# EAGLE schematic L298N_Schematic_v1 (EAGLE 9.7.0)
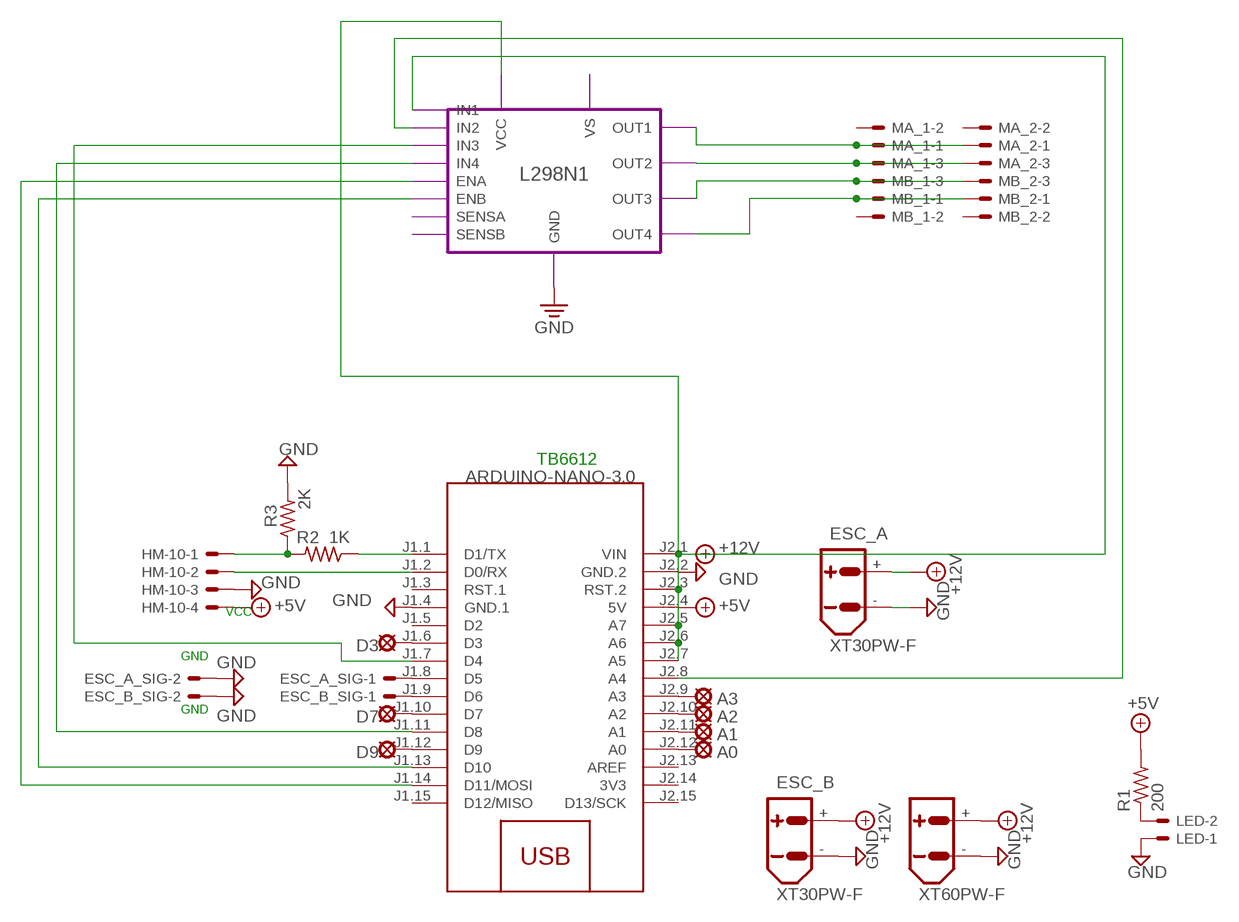
[diagram p0: schematic, sheet 1]

## Parts
A0  LSP10  [LSP10]
A1  LSP10  [LSP10]
A2  LSP10  [LSP10]
A3  LSP10  [LSP10]
BATTERY  XT60PW-F  [XT60PW-F]
D3  LSP10  [LSP10]
D7  LSP10  [LSP10]
D9  LSP10  [LSP10]
ESC_A  XT30PW-F  [XT30PW-F]
ESC_A_SIG  JST-XH-02-PIN-LONG-PAD  [JST-XH-02-PACKAGE-LONG-PAD]
ESC_B  XT30PW-F  [XT30PW-F]
ESC_B_SIG  JST-XH-02-PIN-LONG-PAD  [JST-XH-02-PACKAGE-LONG-PAD]
HM-10  JST-XH-04-PIN-LONG-PAD  [JST-XH-04-PACKAGE-LONG-PAD]
LED  JST-XH-02-PIN-LONG-PAD  [JST-XH-02-PACKAGE-LONG-PAD]
M1  ARDUINO-NANO-3.0  [ARDUINO-NANO-3.0]
MA_1  JST-XH-03-PIN-LONG-PAD  [JST-XH-03-PACKAGE-LONG-PAD]
MA_2  JST-XH-03-PIN-LONG-PAD  [JST-XH-03-PACKAGE-LONG-PAD]
MB_1  JST-XH-03-PIN-LONG-PAD  [JST-XH-03-PACKAGE-LONG-PAD]
MB_2  JST-XH-03-PIN-LONG-PAD  [JST-XH-03-PACKAGE-LONG-PAD]
R1  200  R-US_0204/5  [0204/5]
R2  1K  R-US_0204/5  [0204/5]
R3  2K  R-US_0204/5  [0204/5]

## Module instances
L298N1 = L298N

## Nets
+5V: HM-10.4 M1.J2.4(5V) R1.2
+12V: BATTERY.+ ESC_A.+ ESC_B.+ M1.J2.1(VIN)
GND: BATTERY.- ESC_A.- ESC_A_SIG.2 ESC_B.- ESC_B_SIG.2 HM-10.3 LED.1 M1.J1.4(GND.1) M1.J2.2(GND.2) R3.2 ; port L298N1.GND
N$1: D3.MP M1.J1.6(D3)
N$2: D7.MP M1.J1.10(D7)
N$3: D9.MP M1.J1.12(D9)
N$4: HM-10.1 R2.2 R3.1
N$5: ESC_A_SIG.1 M1.J1.8(D5)
N$6: ESC_B_SIG.1 M1.J1.9(D6)
N$7: M1.J1.1(D1/TX) R2.1
N$9: M1.J2.8(A4) ; port L298N1.IN2
N$10: MA_1.1 MA_2.1 ; port L298N1.OUT1
N$11: MA_1.3 MA_2.3 ; port L298N1.OUT2
N$12: MB_1.1 MB_2.1 ; port L298N1.OUT4
N$13: MB_1.3 MB_2.3 ; port L298N1.OUT3
N$14: HM-10.2 M1.J1.2(D0/RX)
N$15: M1.J2.3(RST.2) M1.J2.5(A7) M1.J2.6(A6) M1.J2.7(A5) ; port L298N1.VCC L298N1.IN1
N$16: M1.J1.7(D4) ; port L298N1.IN3
N$17: M1.J1.11(D8) ; port L298N1.IN4
N$18: LED.2 R1.1
N$20: M1.J1.13(D10) ; port L298N1.ENB
N$21: M1.J1.14(D11/MOSI) ; port L298N1.ENA
N$24: A3.MP M1.J2.9(A3)
N$25: A1.MP M1.J2.11(A1)
N$27: A0.MP M1.J2.12(A0)
N$28: A2.MP M1.J2.10(A2)
Unconnected: M1.J1.3(RST.1) M1.J1.5(D2) M1.J1.15(D12/MISO) M1.J2.13(AREF) M1.J2.15(D13/SCK) MA_1.2 MA_2.2 MB_1.2 MB_2.2

## Notes on the sheet
- TB6612
- VCC
- GND
- GND

## Power pins joined to a net without a drawn wire
3V3: M1.J2.14(3V3)

## Library data of the parts
A0 A1-A3 D3 D7 D9 = solpad:LSP10: SOLDER PAD drill 1.0 mm, distributor Buerklin, 12H555
BATTERY = xt30:XT60: AMASS XT60 connector Store in Japan AMASS XT60 connector <https://szc.jp/ams-xt60>
ESC_A ESC_B = xt30:XT30: AMASS XT30 connector Store in Japan AMASS XT30 connector <https://szc.jp/ams-xt30>
ESC_A_SIG ESC_B_SIG LED = Rembrandt Electronics - JST XH Connectors v1-0:JST-XH-02-PIN: JST XH Connector 2 Pin Wire to board connector. Pitch: 2,54 mm, (0.100") Number of pins: 2 Created by Rembrandt Electronics www.rembrandtelectronics.com
HM-10 = Rembrandt Electronics - JST XH Connectors v1-0:JST-XH-04-PIN: JST XH Connector 2 Pin Wire to board connector. Pitch: 2,54 mm, (0.100") Number of pins: 4 Created by Rembrandt Electronics www.rembrandtelectronics.com
M1 = diy-modules:ARDUINO-NANO-3.0: Arduino Nano 3.0 and compatible devices More details available here: https://www.arduino.cc/en/Main/ArduinoBoardNano Click here to find device on ebay.com <http://www.ebay.com/sch/arduino+nano>
MA_1 MA_2 MB_1 MB_2 = Rembrandt Electronics - JST XH Connectors v1-0:JST-XH-03-PIN: JST XH Connector 2 Pin Wire to board connector. Pitch: 2,54 mm, (0.100") Number of pins: 3 Created by Rembrandt Electronics www.rembrandtelectronics.com
R1-R3 = BeagleBone_Black_Wireless:R-US_: RESISTOR, American symbol

## Module L298
Ports: IN1(in) IN2(in) IN3(in) IN4(in)

### Library data of the parts

## Module L298N
Ports: IN1(oc) IN2(oc) IN3(oc) IN4(oc) ENA(oc) ENB(oc) SENSA(oc) SENSB(oc) GND(oc) VCC(oc) VS(oc) OUT1(oc) OUT2(oc) OUT3(oc) OUT4(oc)

### Library data of the parts

## Module U2
Ports: VO(oc) VI(oc) GND(oc)

### Library data of the parts